# Altium schematic sheet LevelConverter.SchDoc
size A4
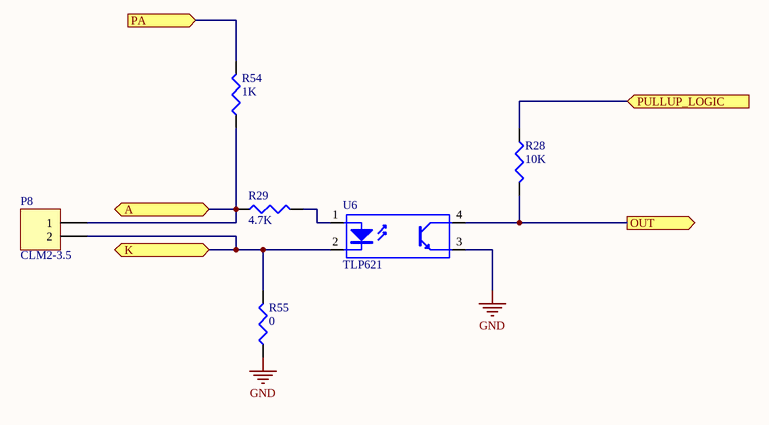
[diagram p0: LevelConverter.SchDoc]

## Parts
P8  CLM2-3.5  [CLM2-3.5]
R28  10K  [R2012[0805]]
R29  4.7K  [R2012[0805]]
R54  1K  [R2012[0805]]
R55  0  [R2012[0805]]
U6  TLP621  [DIP4]

## Ports
A (bidir), K (bidir), OUT (out), PA (in), PULLUP_LOGIC (in)

## Nets
GND: R55.1 U6.3(E)
A: P8.1 R29.1 R54.1 ; port A
K: P8.2 R55.2 U6.2(K) ; port K
OUT: R28.2 U6.4(C) ; port OUT
PA: R54.2 ; port PA
PULLUP_LOGIC: R28.1 ; port PULLUP_LOGIC
NetR29_2: R29.2 U6.1(A)

## Library data of the parts
R28 R29 R54 R55 = R0805: Published: 8-Jun-2000; LatestRevisionDate: 29-May-2009; LatestRevisionNote: IPC-7351 Footprint Added.; PackageReference: J1-0603; Publisher: Altium Limited; PackageDescription: Chip Resistor
  R28: Value: 10K
  R29: Value: 4.7K
  R54: Value: 1K
  R55: Value: 0